# EAGLE design phono_preamp (EAGLE 6.4)
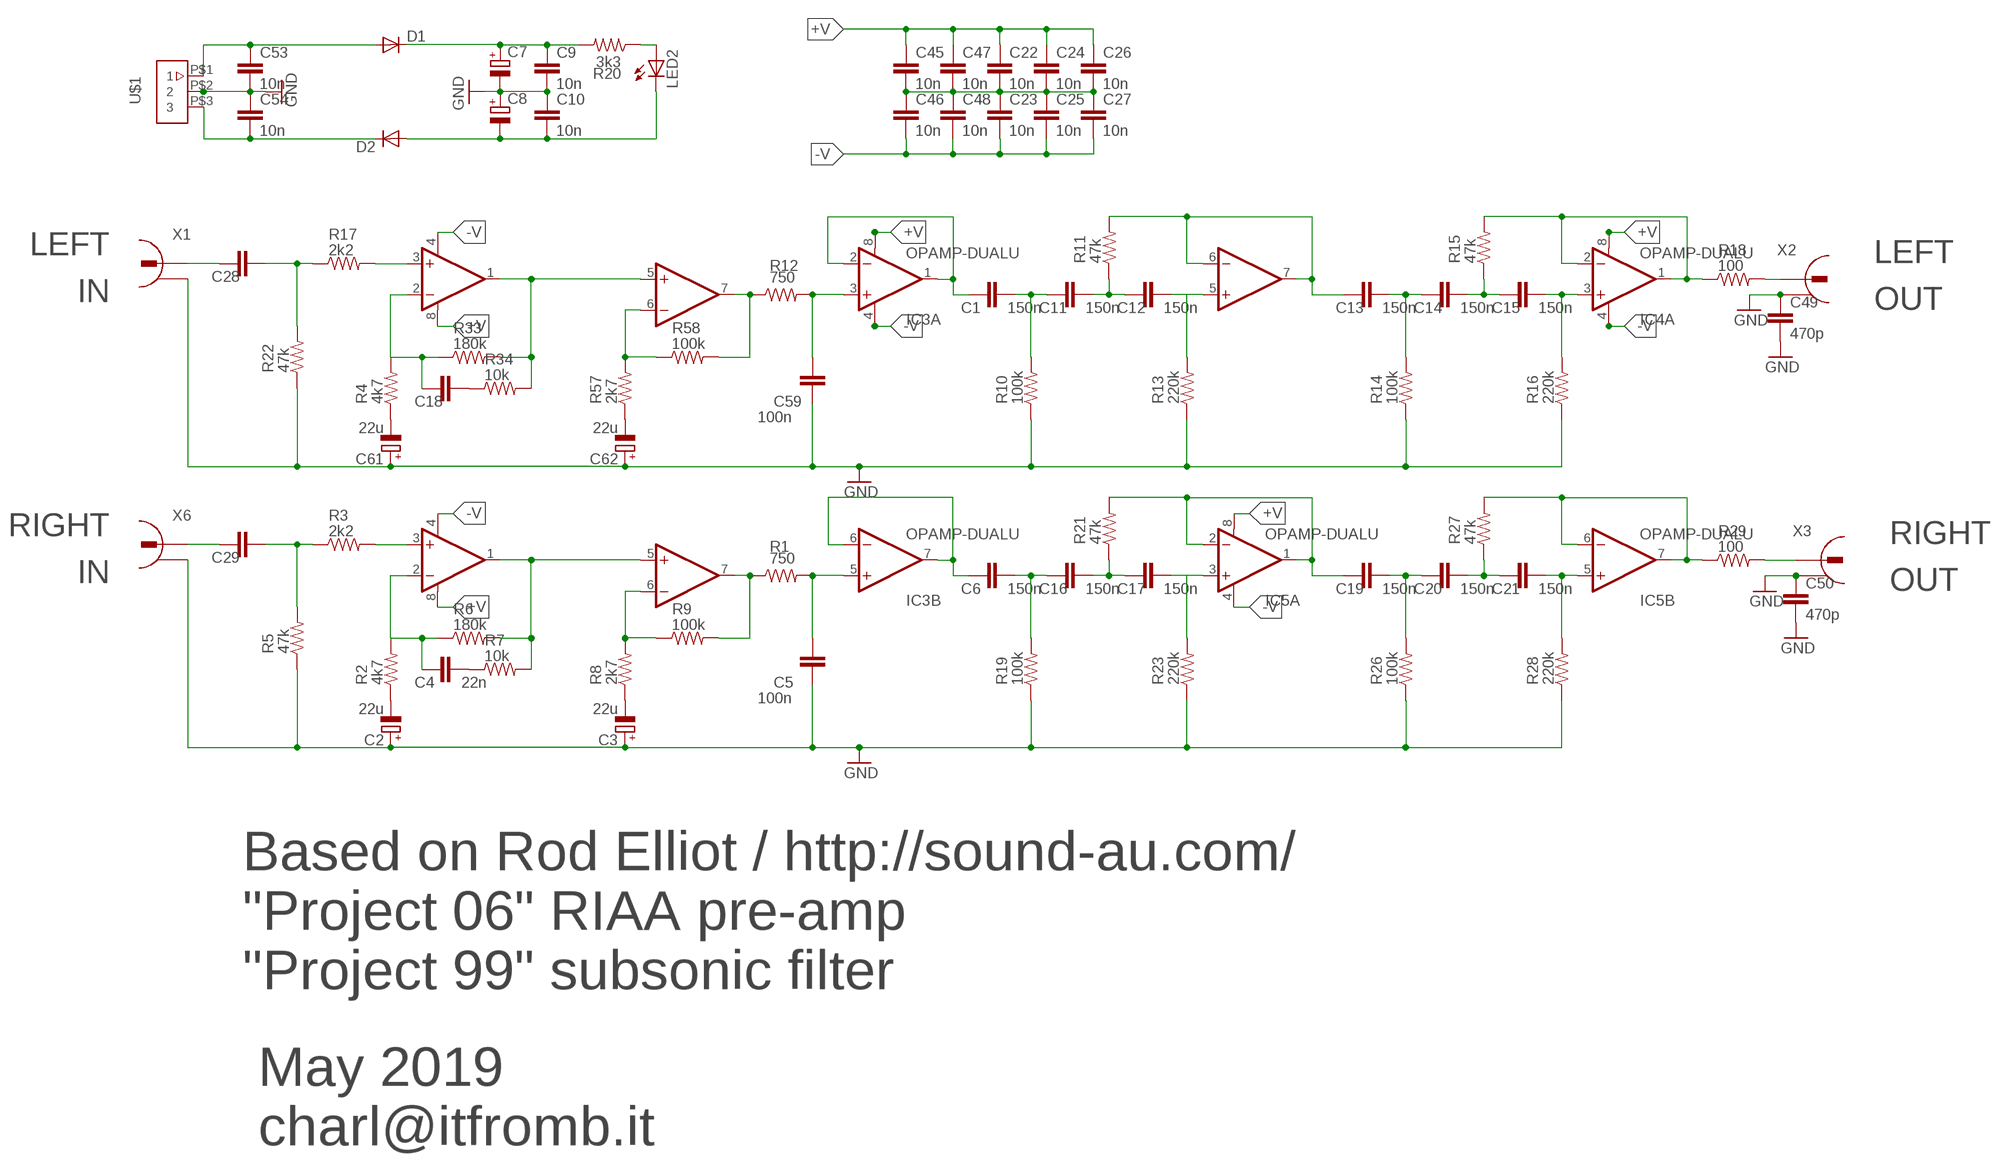
[diagram p0: schematic, sheet 1]

## Parts
C1  150n  C-EUC1206  [C1206]
C2  22u  CPOL-EUC  [PANASONIC_C]
C3  22u  CPOL-EUC  [PANASONIC_C]
C4  22n  C-EUC1206  [C1206]
C5  100n  C-EUC1206  [C1206]
C6  150n  C-EUC1206  [C1206]
C7  CPOL-EUSANYO_SMD_F12  [SANYO-OSCON_SMD_F12]
C8  CPOL-EUSANYO_SMD_F12  [SANYO-OSCON_SMD_F12]
C9  10n  C-EUC1206  [C1206]
C10  10n  C-EUC1206  [C1206]
C11  150n  C-EUC1206  [C1206]
C12  150n  C-EUC1206  [C1206]
C13  150n  C-EUC1206  [C1206]
C14  150n  C-EUC1206  [C1206]
C15  150n  C-EUC1206  [C1206]
C16  150n  C-EUC1206  [C1206]
C17  150n  C-EUC1206  [C1206]
C18  22n  C-EUC1206  [C1206]
C19  150n  C-EUC1206  [C1206]
C20  150n  C-EUC1206  [C1206]
C21  150n  C-EUC1206  [C1206]
C22  10n  C-EUC1206  [C1206]
C23  10n  C-EUC1206  [C1206]
C24  10n  C-EUC1206  [C1206]
C25  10n  C-EUC1206  [C1206]
C26  10n  C-EUC1206  [C1206]
C27  10n  C-EUC1206  [C1206]
C28  C-EUC1206  [C1206]
C29  C-EUC1206  [C1206]
C45  10n  C-EUC1206  [C1206]
C46  10n  C-EUC1206  [C1206]
C47  10n  C-EUC1206  [C1206]
C48  10n  C-EUC1206  [C1206]
C49  470p  C-EUC1206  [C1206]
C50  470p  C-EUC1206  [C1206]
C53  10n  C-EUC1206  [C1206]
C54  10n  C-EUC1206  [C1206]
C59  100n  C-EUC1206  [C1206]
C61  22u  CPOL-EUC  [PANASONIC_C]
C62  22u  CPOL-EUC  [PANASONIC_C]
D1  DIODE-DO214AA  [DO214AA]
D2  DIODE-DO214AA  [DO214AA]
IC1  OPAMP-DUALU  [SO08]
IC2  OPAMP-DUALU  [SO08]
IC3  OPAMP-DUALU  [SO08]
IC4  OPAMP-DUALU  [SO08]
IC5  OPAMP-DUALU  [SO08]
LED2  LEDCHIPLED_1206  [CHIPLED_1206]
R1  750  R-US_M1206  [M1206]
R2  4k7  R-US_M1206  [M1206]
R3  2k2  R-US_M1206  [M1206]
R4  4k7  R-US_M1206  [M1206]
R5  47k  R-US_M1206  [M1206]
R6  180k  R-US_M1206  [M1206]
R7  10k  R-US_M1206  [M1206]
R8  2k7  R-US_M1206  [M1206]
R9  100k  R-US_M1206  [M1206]
R10  100k  R-US_M1206  [M1206]
R11  47k  R-US_M1206  [M1206]
R12  750  R-US_M1206  [M1206]
R13  220k  R-US_M1206  [M1206]
R14  100k  R-US_M1206  [M1206]
R15  47k  R-US_M1206  [M1206]
R16  220k  R-US_M1206  [M1206]
R17  2k2  R-US_M1206  [M1206]
R18  100  R-US_M1206  [M1206]
R19  100k  R-US_M1206  [M1206]
R20  3k3  R-US_M1206  [M1206]
R21  47k  R-US_M1206  [M1206]
R22  47k  R-US_M1206  [M1206]
R23  220k  R-US_M1206  [M1206]
R26  100k  R-US_M1206  [M1206]
R27  47k  R-US_M1206  [M1206]
R28  220k  R-US_M1206  [M1206]
R29  100  R-US_M1206  [M1206]
R33  180k  R-US_M1206  [M1206]
R34  10k  R-US_M1206  [M1206]
R57  2k7  R-US_M1206  [M1206]
R58  100k  R-US_M1206  [M1206]
U$1  3-PIN-JST-CONN-1.25MM-PITCH  [S3B-PH-VERTICAL]
X1  736880-49RCA-REAR-MOUNT  [RCA-REAR-MOUNT]
X2  736880-49RCA-REAR-MOUNT  [RCA-REAR-MOUNT]
X3  736880-49RCA-REAR-MOUNT  [RCA-REAR-MOUNT]
X6  736880-49RCA-REAR-MOUNT  [RCA-REAR-MOUNT]

## Nets
+V: C7.+ C9.1 C22.1 C24.1 C26.1 C45.1 C47.1 D1.C IC1.8(A:V+) IC2.8(A:V+) IC3.8(A:V+) IC4.8(A:V+) IC5.8(A:V+) R20.2
-V: C8.- C10.2 C23.2 C25.2 C27.2 C46.2 C48.2 D2.A IC1.4(A:V-) IC2.4(A:V-) IC3.4(A:V-) IC4.4(A:V-) IC5.4(A:V-) LED2.C
GND: C2.+ C3.+ C5.1 C7.- C8.+ C9.2 C10.1 C22.2 C23.1 C24.2 C25.1 C26.2 C27.1 C45.2 C46.1 C47.2 C48.1 C49.1 C49.2 C50.1 C50.2 C53.2 C54.1 C59.1 C61.+ C62.+ R5.1 R10.1 R13.1 R14.1 R16.1 R19.1 R22.1 R23.1 R26.1 R28.1 U$1.P$2 X1.RING X2.RING X3.RING X6.RING
N$1: C1.1 IC3.1(A:OUT) IC3.2(A:-IN)
N$2: C5.2 IC3.5(B:+IN) R1.2
N$3: C13.1 IC4.6(B:-IN) IC4.7(B:OUT) R11.2
N$4: C2.- R2.1
N$5: C4.1 IC1.2(A:-IN) R2.2 R6.1
N$6: C61.- R4.1
N$7: C29.2 R3.1 R5.2
N$8: IC1.3(A:+IN) R3.2
N$9: C4.2 R7.1
N$10: IC1.1(A:OUT) IC1.5(B:+IN) R6.2 R7.2
N$11: C3.- R8.1
N$12: IC1.6(B:-IN) R8.2 R9.1
N$13: IC1.7(B:OUT) R1.1 R9.2
N$14: C12.2 IC4.5(B:+IN) R13.2
N$15: C11.2 C12.1 R11.1
N$16: C1.2 C11.1 R10.2
N$17: R18.2 X2.SIGNAL
N$18: IC4.1(A:OUT) IC4.2(A:-IN) R15.2 R18.1
N$19: C15.2 IC4.3(A:+IN) R16.2
N$20: C18.1 IC2.2(A:-IN) R4.2 R33.1
N$21: C14.2 C15.1 R15.1
N$22: C28.2 R17.1 R22.2
N$23: C13.2 C14.1 R14.2
N$24: C6.1 IC3.6(B:-IN) IC3.7(B:OUT)
N$25: C19.1 IC5.1(A:OUT) IC5.2(A:-IN) R21.2
N$26: C17.2 IC5.3(A:+IN) R23.2
N$27: C16.2 C17.1 R21.1
N$28: C6.2 C16.1 R19.2
N$29: IC5.6(B:-IN) IC5.7(B:OUT) R27.2 R29.1
N$30: C21.2 IC5.5(B:+IN) R28.2
N$31: C20.2 C21.1 R27.1
N$32: C53.1 D1.A U$1.P$1
N$34: C54.2 D2.C U$1.P$3
N$36: C19.2 C20.1 R26.2
N$38: LED2.A R20.1
N$39: R29.2 X3.SIGNAL
N$40: IC2.3(A:+IN) R17.2
N$41: C28.1 X1.SIGNAL
N$42: C29.1 X6.SIGNAL
N$56: IC2.7(B:OUT) R12.1 R58.2
N$68: C18.2 R34.1
N$71: C59.2 IC3.3(A:+IN) R12.2
N$77: IC2.1(A:OUT) IC2.5(B:+IN) R33.2 R34.2
N$78: C62.- R57.1
N$79: IC2.6(B:-IN) R57.2 R58.1

## Notes on the sheet
- LEFT
- LEFT
- IN
- OUT
- RIGHT
- RIGHT
- IN
- OUT
- Based on Rod Elliot / http://sound-au.com/
  "Project 06" RIAA pre-amp
  "Project 99" subsonic filter
- May 2019
  charl@itfromb.it

## Library data of the parts
C1 C4-C6 C9-C29 C45-C50 C53 C54 C59 = rcl:C-EU: CAPACITOR, European symbol
C2 C3 C61 C62 = rcl:CPOL-EU: POLARIZED CAPACITOR, European symbol
C7 C8 = stereo_5.1_mixer:CPOL-EU: POLARIZED CAPACITOR, European symbol
D1 D2 = diode:DIODE-: DIODE
IC1-IC5 = SparkFun:OPAMP-DUAL: Operational Amplifier
LED2 = led:LED: LED OSRAM: - CHIPLED LG R971, LG N971, LY N971, LG Q971, LY Q971, LO R971, LY R971 LH N974, LH R974 LS Q976, LO Q976, LY Q976 LO Q996 - Hyper CHIPLED LW Q18S LB Q993, LB Q99A, LB R99A - SideLED LS A670, LO A670, LY A670, LG A670, LP A670 LB A673, LV A673, LT A673, LW A673 LH A674 LY A675 LS A676, LA A676, LO A676, LY A676, LW A676 LS A679, LY A679, LG A679 - Hyper Micro SIDELED® LS Y876, LA Y876, LO Y876, LY Y876 LT Y87S - SmartLED LW L88C, LW L88S LB L89C, LB L89S, LG L890 LS L89K, LO L89K, LY L89K LS L896, LA L896, LO L896, LY L896 - TOPLED LS T670, LO T670, LY T670, LG T670, LP T670 LSG T670, LSP T670, LSY T670, LOP T670, LYG T670 LG T671, LOG T671, LSG T671 LB T673, LV T673, LT T673, LW T673 LH T674 LS T676, LA T676, LO T676, LY T676, LB T676, LH T676, LSB T676, LW T676 LB T67C, LV T67C, LT T67C, LS T67K, LO T67K, LY T67K, LW E67C LS E67B, LA E67B, LO E67B, LY E67B, LB E67C, LV E67C, LT E67C LW T67C LS T679, LY T679, LG T679 LS T770, LO T770, LY T770, LG T770, LP T770 LB T773, LV T773, LT T773, LW T773 LH T774 LS E675, LA E675, LY E675, LS T675 LS T776, LA T776, LO T776, LY T776, LB T776 LHGB T686 LT T68C, LB T68C - Hyper Mini TOPLED® LB M676 - Mini TOPLED Santana® LG M470 LS M47K, LO M47K, LY M47K Source: http://www.osram.convergy.de LUXEON: - LUMILED® LXK2-PW12-R00, LXK2-PW12-S00, LXK2-PW14-U00, LXK2-PW14-V00 LXK2-PM12-R00, LXK2-PM12-S00, LXK2-PM14-U00 LXK2-PE12-Q00, LXK2-PE12-R00, LXK2-PE12-S00, LXK2-PE14-T00, LXK2-PE14-U00 LXK2-PB12-K00, LXK2-PB12-L00, LXK2-PB12-M00, LXK2-PB14-N00, LXK2-PB14-P00, LXK2-PB14-Q00 LXK2-PR12-L00, LXK2-PR12-M00, LXK2-PR14-Q00, LXK2-PR14-R00 LXK2-PD12-Q00, LXK2-PD12-R00, LXK2-PD12-S00 LXK2-PH12-R00, LXK2-PH12-S00 LXK2-PL12-P00, LXK2-PL12-Q00, LXK2-PL12-R00 Source: www.luxeon.com KINGBRIGHT: KA-3528ASYC Source: www.kingbright.com
R1-R23 R26-R29 R33 R34 R57 R58 = rcl:R-US_: RESISTOR, American symbol
U$1 = stereo_5.1_mixer:3-PIN-JST-CONN-1.25MM-PITCH
X1-X3 X6 = stereo_5.1_mixer:736880-49: Cinch Connector ( RCA Jack )

## Board
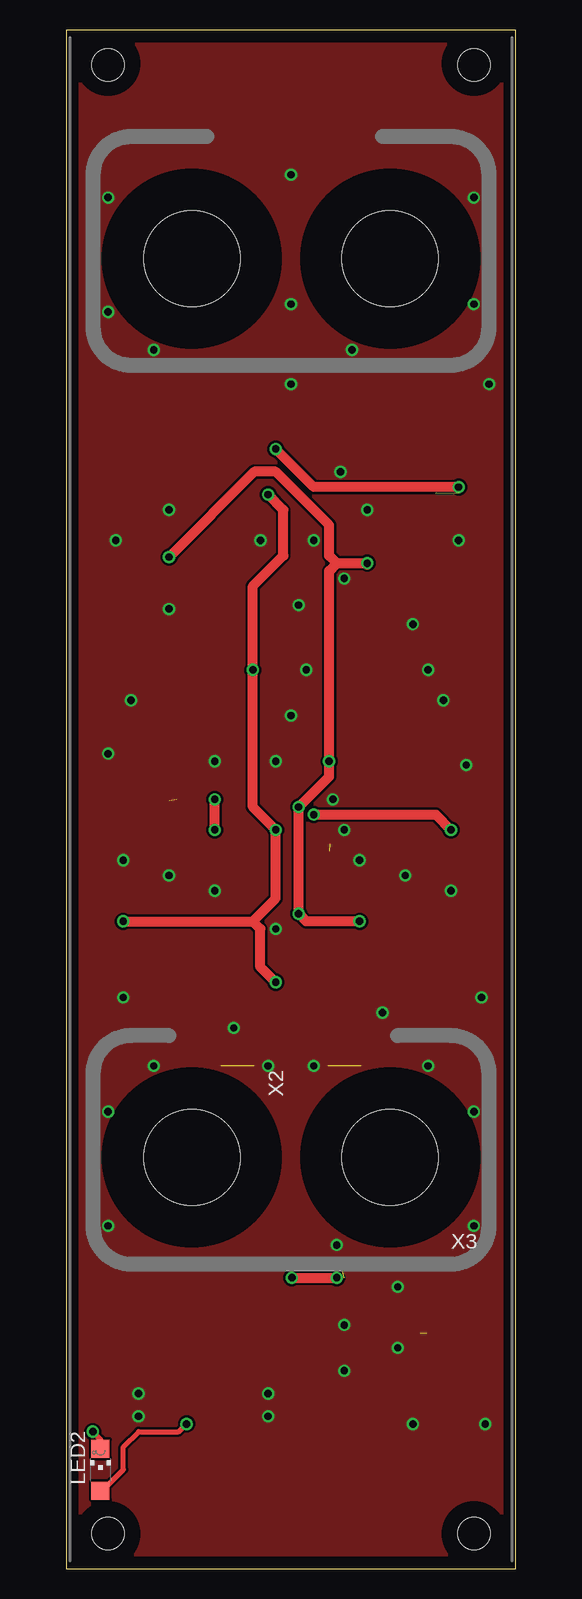
[diagram p1: board, top side]
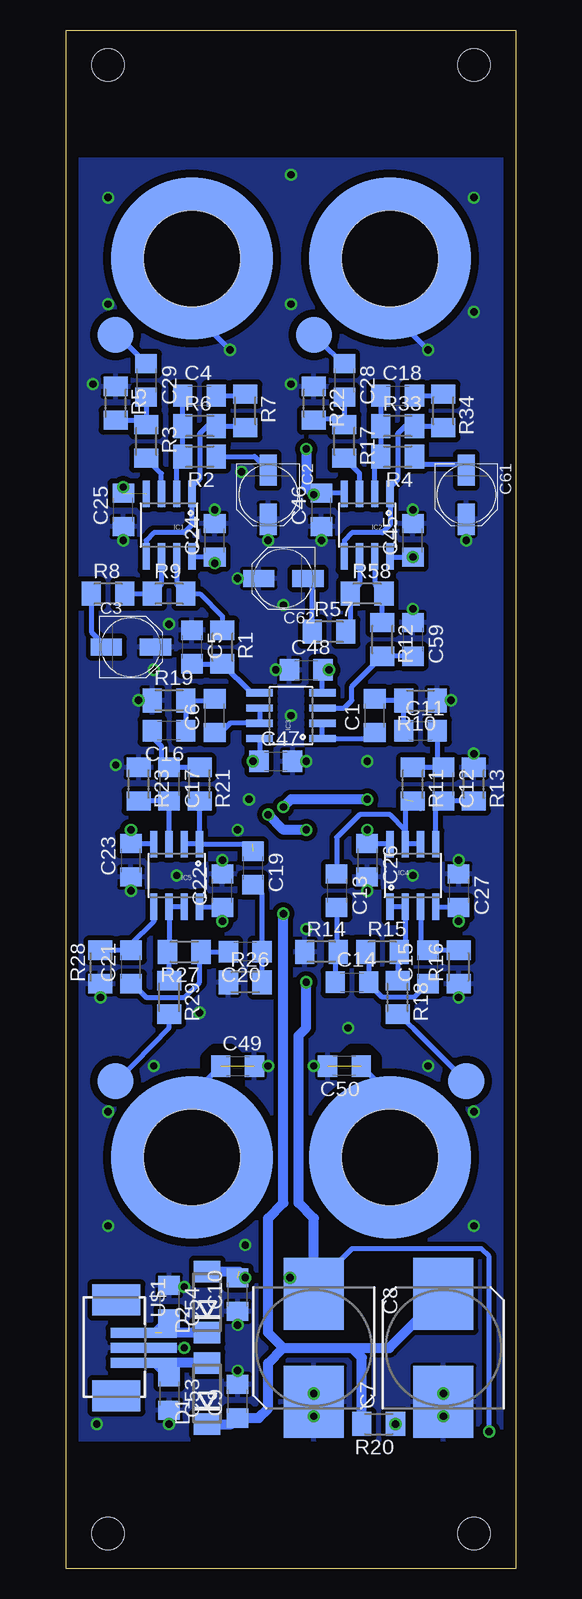
[diagram p2: board, bottom side, seen from below]

Size 37.47 x 128.27 mm. Coordinates in mm from the lower left corner, seen from the top.
Outline: 0,0 37.46,0 37.46,128.27 0,128.27 0,0
Copper layers (1*16): Top 0.035mm / dielectric 1.5mm / Bottom 0.035mm
Design rules "default *": minimum track width 10mil, minimum drill 24mil, track to track 8mil, track to pad 8mil, pad to pad 8mil, via to via 8mil, smd to smd 0mil, copper to edge 40mil, drill to drill 8mil, minimum pad ring 10mil, minimum via ring 8mil, stop-mask expansion 4mil, vias tented up to drill 0mil, thermal gap 10mil
Holes 2.7 mm at 3.49,125.35 3.49,2.92 33.97,2.92 33.97,125.35
tRestrict: area 1.2,0.6 to 5.8,5.2; area 1.2,123.2 to 5.8,127.8; area 31.7,0.6 to 36.3,5.2; area 31.7,123.2 to 36.3,127.8
bRestrict: 10 lines

### Footprints (pad centres in the part's own frame; a part is rotated, then mirrored left to right if it is on the bottom)
C1206 = smd 1.6 x 1.8: 1 -1.4,0; 2 1.4,0
PANASONIC_C = smd 2.6 x 1.4: + 2.05,0; - -2.05,0
SANYO-OSCON_SMD_F12 = smd 6 x 5: + 4.5,0; - -4.5,0
DO214AA = smd 1.8 x 2.2: A 2.55,0; C -2.55,0
SO08 = smd 0.61 x 2.21: 1 -1.905,-2.616; 2 -0.635,-2.616; 3 0.635,-2.616; 4 1.905,-2.616; 5 1.905,2.616; 6 0.635,2.616; 7 -0.635,2.616; 8 -1.905,2.616
CHIPLED_1206 = smd 1.5 x 1.5: A 0,-1.75; C 0,1.75
M1206 = smd 1.6 x 2: 1 -1.4,0; 2 1.4,0
S3B-PH-VERTICAL = smd 0.8 x 5.5: P$1 -1.25,-2; P$2 0,-2; P$3 1.25,-2 | smd 2.6 x 4: P$4 -4,0.27; P$5 4,0.27
RCA-REAR-MOUNT = smd 13.5 x 13.5 bottom: RING 0,0 | smd 3 x 3 bottom: SIGNAL 6.35,6.35 | hole 8: 0,0

### Placement (x,y rotation side)
C1  11.75,71.12 90 bottom
C2  20.64,89.53 270 bottom
C3  32.07,76.84 0 bottom
C4  26.35,97.79 0 bottom
C5  26.99,76.84 270 bottom
C6  25.08,71.12 90 bottom
C7  6.03,18.42 90 bottom
C8  16.83,18.42 270 bottom
C9  23.18,13.97 90 bottom
C10  23.18,22.86 90 bottom
C11  7.94,69.85 0 bottom
C12  6.03,65.41 270 bottom
C13  14.92,56.52 270 bottom
C14  13.65,48.9 0 bottom
C15  7.3,50.17 90 bottom
C16  28.89,69.85 180 bottom
C17  28.89,65.41 270 bottom
C18  9.84,97.79 0 bottom
C19  21.91,58.42 270 bottom
C20  22.54,51.44 180 bottom
C21  32.07,50.17 90 bottom
C22  24.45,56.52 90 bottom
C23  32.07,59.06 90 bottom
C24  25.08,85.73 90 bottom
C25  32.7,88.27 90 bottom
C26  12.38,59.06 270 bottom
C27  4.76,56.52 270 bottom
C28  14.29,99.06 270 bottom
C29  30.8,99.06 270 bottom
C45  8.57,85.73 90 bottom
C46  16.19,88.27 90 bottom
C47  20,67.31 0 bottom
C48  17.46,74.93 0 bottom
C49  23.18,41.91 0 bottom
C50  14.29,41.91 180 bottom
C53  28.89,14.61 270 bottom
C54  28.89,22.23 270 bottom
C59  8.57,77.47 270 bottom
C61  4.13,89.53 270 bottom
C62  19.37,82.55 180 bottom
D1  25.72,14.61 90 bottom
D2  25.72,22.23 90 bottom
IC1  28.89,87 180 bottom
IC2  12.38,87 180 bottom
IC3  18.73,71.12 90 bottom
IC4  8.57,57.79 0 bottom
IC5  28.26,57.79 180 bottom
LED2  2.86,8.26 0 top
R1  24.45,76.84 270 bottom
R2  26.35,92.71 180 bottom
R3  30.8,93.98 270 bottom
R4  9.84,92.71 180 bottom
R5  33.34,97.16 270 bottom
R6  26.35,95.25 0 bottom
R7  22.54,96.52 270 bottom
R8  33.97,81.28 0 bottom
R9  28.89,81.28 0 bottom
R10  7.94,72.39 180 bottom
R11  8.57,65.41 270 bottom
R12  11.11,77.47 270 bottom
R13  3.49,65.41 270 bottom
R14  16.19,51.44 0 bottom
R15  11.11,51.44 0 bottom
R16  4.76,50.17 90 bottom
R17  14.29,93.98 270 bottom
R18  9.84,47.62 270 bottom
R19  28.89,72.39 0 bottom
R20  11.43,12.07 180 bottom
R21  26.35,65.41 270 bottom
R22  16.83,97.16 270 bottom
R23  31.43,65.41 270 bottom
R26  22.54,48.9 0 bottom
R27  27.62,51.44 180 bottom
R28  34.61,50.17 90 bottom
R29  28.89,47.62 270 bottom
R33  9.84,95.25 0 bottom
R34  6.03,96.52 270 bottom
R57  15.56,78.11 0 bottom
R58  12.38,81.28 0 bottom
U$1  33.02,18.42 90 bottom
X1  10.48,109.22 270 top
X2  10.48,34.29 90 top
X3  26.99,34.29 0 top
X6  26.99,109.22 270 top

### Tracks (layer width: path | path; a pad name or v marks a point on that pad's centre or on a via)
+V  (via drill 0.61)
  Top 0.813: v24.45,53.98 20,53.98 v19.37,54.61 v19.37,63.5 21.91,66.04 v21.91,67.31 21.91,83.19 22.54,83.82 | 22.54,83.82 24.95,83.82 25.08,83.69 v25.08,83.82 | v12.38,61.6 v12.38,64.14 | 22.54,83.82 21.91,84.46 21.91,87 17.46,91.44 15.69,91.44 C45.1
  Bottom 0.406: IC2.8 10.42,84.33 8.7,84.33 | IC1.8 25.14,84.38 C24.1 | IC3.8 21.35,67.36 C47.1 | IC4.8 12.33,60.4 C26.1 | IC5.8 24.5,55.17 C22.1
  Bottom 0.813: D1.C 23.69,12.06 C9.1 21.4,12.57 20.64,13.34 20.64,17.15 19.37,18.42 | 19.37,18.42 13.65,18.42 | 13.65,18.42 10.53,18.42 C7.+ | R20.2 12.83,17.59 13.65,18.42 | 19.37,18.42 20.64,19.69 20.64,29.21 19.37,30.48 v19.37,54.61 | C22.1 24.58,55.12 v24.45,53.98 | C26.1 v12.38,61.6 | v12.38,64.14 18.73,64.14 v19.37,63.5 | C45.1 8.7,84.33 8.57,84.46 | C24.1 v25.08,83.82 | C47.1 21.4,66.81 v21.91,67.31
  other vias: 8.57,84.33
-V  (via drill 0.61)  (2 unrouted)
  Top 0.406: LED2.C 2.86,10.8 v2.22,11.43
  Top 0.813: v17.46,48.9 16.19,50.17 16.19,53.34 15.56,53.98 | v16.83,89.53 18.1,88.27 18.1,84.46 15.56,81.92 v15.56,74.93 15.56,63.5 v17.46,61.6 17.46,55.88 15.56,53.98 | v20.64,62.87 30.8,62.87 v32.07,61.6 | v4.76,53.98 15.56,53.98 | v32.7,90.17 20.64,90.17 v17.46,93.34 | v18.81,24.26 v22.54,24.26
  Bottom 0.406: IC2.4 14.34,89.67 C46.2 | IC3.4 16.12,74.88 C48.2 | C27.2 6.61,55.12 IC4.4 | v2.22,11.43 2.22,26.04 2.86,26.67 13.65,26.67 16.83,23.5 | IC5.4 32.01,60.4 C23.2
  Bottom 0.813: D2.A 23.06,24.78 v22.54,24.26 | v18.81,24.26 C8.- 16.83,23.5 16.83,29.21 18.1,30.48 18.1,44.45 17.46,45.09 v17.46,48.9 | v17.46,61.6 19.37,61.6 v20.64,62.87 | C48.2 v15.56,74.93 | C46.2 16.32,89.53 v16.83,89.53 17.46,90.17 v17.46,93.34 | C25.2 v32.7,90.17 | v32.07,61.6 C23.2 | v4.76,53.98 C27.2
GND  (via drill 0.61)  (2 unrouted)
  Bottom 0.406: X1.RING 10.48,104.78 v7.3,101.6 | X6.RING 26.99,104.78 v23.81,101.6 | C49.1 26.99,39.5 X3.RING | C50.1 10.48,39.5 X2.RING
  other vias: 4.13,85.73 23.18,82.55 20.64,85.73 25.08,88.27 32.7,85.73 16.19,85.73 8.57,88.27 20,74.93 17.46,67.31 12.38,56.52 4.76,59.06 24.45,59.06 32.07,56.52 20.64,41.91 16.83,41.91 30.16,74.93 6.03,14.61 6.03,12.7 16.83,14.61 16.83,12.7 23.18,20.32 23.18,16.51 27.62,18.42 28.89,12.07 27.62,23.5 4.76,47.62 34.61,47.62 31.43,72.39 5.4,72.39 8.57,80.01 28.89,78.74 18.73,71.12 8.57,57.79 28.26,57.79 3.49,67.95 12.38,67.31 22.23,64.14 23.18,61.6 13.97,45.09 7.3,41.91 3.49,38.1 33.97,38.1 30.16,41.91 26.35,46.36 22.54,26.99 3.49,28.58 33.97,28.58 34.92,12.07 33.34,66.99 19.37,80.33 22.86,91.44 18.73,98.74 35.24,98.74 18.73,105.41 33.97,105.41 3.49,104.78 3.49,114.3 18.73,116.21 33.97,114.3 17.46,53.34
  pour Top (rank 4): 0.32,0 37.15,0 37.15,128.27 0.32,128.27
  pour Bottom (isolate 0.406, rank 5): 37.15,117.48 0.32,117.48 0.32,10.8 37.15,10.8
N$1
  Bottom 0.406: IC3.2 IC3.1 12.25,69.22 C1.1
N$2
  Bottom 0.406: C5.2 R1.2 22.04,73.03 IC3.5
N$3  (1 unrouted)
  Bottom 0.406: 7.94,63.37 R11.2 | IC4.6 IC4.7 9.21,61.6 | 9.21,64.14 9.21,61.6 | 9.21,61.6 10.48,62.87 13.02,62.87 14.92,60.96 C13.1
N$4
  Bottom 0.406: R2.1 21.76,92.71 C2.-
N$5
  Bottom 0.406: IC1.2 28.26,92.21 R2.2 R6.1 C4.1
N$6
  Bottom 0.406: R4.1 7.94,92.08 4.62,92.08 C61.-
N$7
  Bottom 0.406: C29.2 R3.1 31.17,95.76 R5.2
N$8
  Bottom 0.406: IC1.3 29.53,91.31 R3.2
N$9
  Bottom 0.406: C4.2 22.67,97.79 R7.1
N$10
  Bottom 0.406: R7.2 22.67,95.25 R6.2 25.72,95.25 26.35,94.62 26.35,90.81 26.99,90.17 IC1.1 26.99,87 27.62,86.36 30.16,86.36 30.8,85.73 IC1.5
N$11
  Bottom 0.406: R8.1 35.37,78.09 C3.-
N$12
  Bottom 0.406: IC1.6 29.53,82.05 R9.1 R8.2
N$13
  Bottom 0.406: IC1.7 28.26,82.05 R9.2 26.35,81.28 24.45,79.38 R1.1
N$14
  Bottom 0.406: IC4.5 6.67,63.37 C12.2 R13.2
N$15
  Bottom 0.406: R11.1 C12.1 6.54,67.31 C11.2
N$16
  Bottom 0.406: C11.1 R10.2 11.62,72.39 C1.2
N$17
  Bottom 0.406: X2.SIGNAL 8.44,44.96 R18.2
N$18
  Bottom 0.406: IC4.1 IC4.2 9.21,51.94 R15.2 9.84,51.31 R18.1
N$19
  Bottom 0.406: IC4.3 7.94,52.2 C15.2 R16.2
N$20
  Bottom 0.406: IC2.2 11.75,92.21 R4.2 R33.1 C18.1
N$21
  Bottom 0.406: C15.1 8.44,47.62 11.11,47.62 12.25,48.77 C14.2 12.25,51.18 R15.1
N$22
  Bottom 0.406: C28.2 14.29,95.89 | 14.29,95.89 R17.1 | R22.2 16.7,95.89 14.29,95.89
N$23
  Bottom 0.406: C14.1 15.05,51.18 R14.2 14.92,51.57 C13.2
N$24
  Bottom 0.406: IC3.6 IC3.7 23.81,70.48 24.45,69.85 24.95,69.85 C6.1
N$25  (1 unrouted)
  Bottom 0.406: IC5.1 IC5.2 | IC5.1 R21.2 | IC5.1 21.96,60.4
N$26
  Bottom 0.406: IC5.3 C17.2 R23.2
N$27
  Bottom 0.406: C16.2 30.29,69.34 29.53,68.58 29.53,67.44 C17.1 R21.1
N$28
  Bottom 0.406: C6.2 25.21,72.39 R19.2 C16.1
N$29
  Bottom 0.406: IC5.7 IC5.6 28.89,51.57 R27.2 28.89,51.31 R29.1
N$30
  Bottom 0.406: IC5.5 30.16,53.98 32.07,52.07 C21.2 R28.2
N$31
  Bottom 0.406: C21.1 31.94,48.77 30.8,47.62 27.62,47.62 26.35,48.9 26.35,51.31 R27.1 C20.2
N$32
  Bottom 0.813: U$1.P$1 30.16,17.17 | 30.16,17.17 30.05,17.17 C53.1 | D1.A 30.15,17.16 30.16,17.17
N$34  (1 unrouted)
  Bottom 0.813: U$1.P$3 30.05,19.67 C54.2 | D2.C 29.52,19.68 29.53,19.69
N$36
  Bottom 0.406: R26.2 C20.1 21.14,56.26 C19.2
N$38  (via drill 0.61)
  Top 0.406: LED2.A 3.01,6.51 4.76,8.26 4.76,10.16 6.03,11.43 9.4,11.43 R20.1
  Bottom 0.406: 9.84,12.07 R20.1
  other vias: 10.03,12.07
N$39
  Bottom 0.406: X3.SIGNAL 33.21,40.64 28.89,45.09 R29.2
N$40
  Bottom 0.406: IC2.3 13.02,91.31 R17.2
N$41
  Bottom 0.406: X1.SIGNAL 16.83,102.74 C28.1
N$42
  Bottom 0.406: X6.SIGNAL 33.21,102.87 C29.1
N$56
  Bottom 0.406: IC2.7 11.75,82.05 R58.2 11.11,81.15 R12.1
N$68
  Bottom 0.406: C18.2 6.16,97.79 R34.1
N$71
  Bottom 0.406: C59.2 R12.2 13.65,73.53 13.65,72.39 14.29,71.76 IC3.3
N$77
  Bottom 0.406: IC2.5 14.29,85.73 13.65,86.36 11.11,86.36 10.48,87 IC2.1 10.48,90.17 9.84,90.81 9.84,94.62 9.21,95.25 R33.2 6.16,95.25 R34.2
N$78
  Bottom 0.406: R57.1 16.96,82.19 C62.-
N$79
  Bottom 0.406: R57.2 13.78,78.48 R58.1 13.02,82.05 IC2.6

### Text on the board
tDocu: IN | L | R | RIAA pre-amp | Butterworth HPF | 6th order | f = | 18 | Hz | -3dB | OUT | L | R | PHONO PREAMP
bDocu: -15V | +15V